# Altium schematic sheet Sensor.SchDoc
size A0
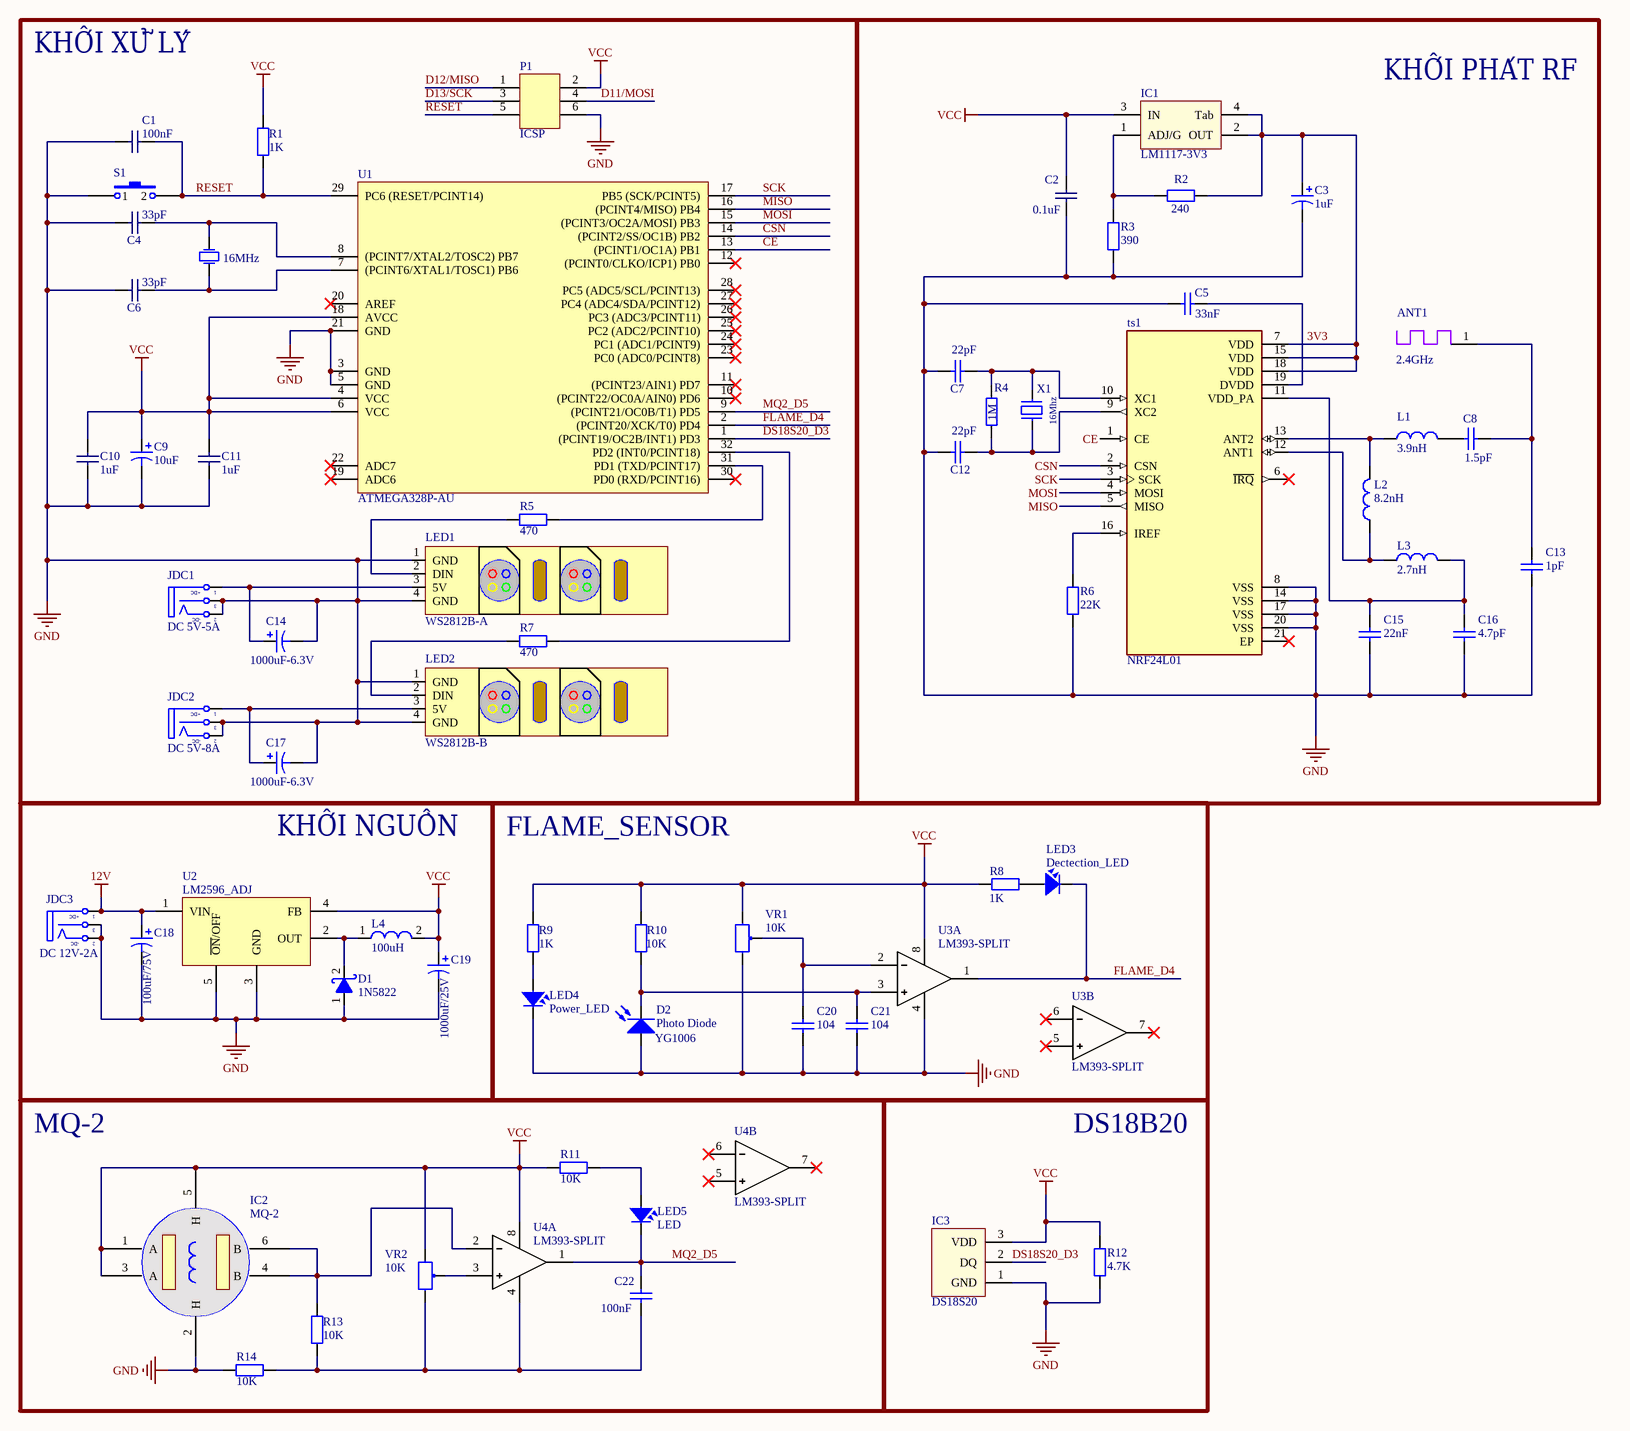
[diagram p0: Sensor.SchDoc]

## Parts
ANT1  2.4GHz  [PATCH ANTEN 2.45GHZ]
C1  100nF  [CAP0603]
C2  0.1uF  [CAPC0805]
C3  1uF  [CAP_0805]
C4  33pF  [CAP0603]
C5  33nF  [CAPC0805]
C6  33pF  [CAP0603]
C7  22pF  [CAPC0805]
C8  1.5pF  [CAPC0805]
C9  10uF  [CAP1206_TANTALUM_YELLOW]
C10  1uF  [CAP0603]
C11  1uF  [CAP0603]
C12  22pF  [CAPC0805]
C13  1pF  [CAPC0805]
C14  1000uF-6.3V  [CAP-ALU-SMD-J]
C15  22nF  [CAPC0805]
C16  4.7pF  [CAPC0805]
C17  1000uF-6.3V  [CAP-ALU-SMD-J]
C18  100uF/75V  [C5mm]
C19  1000uF/25V  [C5mm]
C20  104  [C0805]
C21  104  [C0805]
C22  100nF  [CAP_0805]
D1  1N5822  [DIOAD3070W130L950D530]
D2  Photo Diode  [LED-5 GRe]
IC1  LM1117-3V3  [SOT223-4N]
IC2  MQ-2  [MQ-2]
IC3  DS18S20  [JP3-C1T]
JDC1  DC 5V-5A  [DC-IN]
JDC2  DC 5V-8A  [DC-IN]
JDC3  DC 12V-2A  [DC-IN]
L1  3.9nH  [INDC_DR127-1]
L2  8.2nH  [INDC_DR127-1]
L3  2.7nH  [INDC_DR127-1]
L4  100uH  [Inductor_SMD]
LED1  WS2812B-A  [WS2812B]
LED2  WS2812B-B  [WS2812B]
LED3  Dectection_LED  [LED-0805-Blue]
LED4  Power_LED  [LED-0805-Red]
LED5  LED  [LED-0805-Red]
P1  ICSP  [HDR_M_2X3_2.54]
R1  1K  [DIEN TRO 0805]
R2  240  [RES_SMD_0805]
R3  390  [RES_SMD_0805]
R4  1M  [RES_SMD_0805]
R5  470  [DIEN TRO 0805]
R6  22K  [RES_SMD_0805]
R7  470  [DIEN TRO 0805]
R8  1K  [DIEN TRO 0805]
R9  value 1K  [DIEN TRO 0805]  (hidden comment: R0805)
R10  10K  [DIEN TRO 0805]
R11  10K  [DIEN TRO 0805]
R12  4.7K  [RES-SMD-0805]
R13  10K  [DIEN TRO 0805]
R14  10K  [DIEN TRO 0805]
S1  RESET  [SW_B3U-1000P]  (value not drawn)
ts1  NRF24L01  [QFN50P400X400X95-21N]
U1  ATMEGA328P-AU  [TQFP-32]
U2  LM2596_ADJ  [TO263-5]
U3  LM393-SPLIT  [SO8]  (parts A,B of 2)
U4  LM393-SPLIT  [SO8]  (parts A,B of 2)
VR1  10K  [VR1]
VR2  10K  [VR1]
X1  16Mhz  [XTAL_SMD_HC-49S]
Y1  16MHz  [XTAL_SMD_HC-49S]

## Blocks framed on the sheet
KHỐI XỬ LÝ: C1 C4 C6 C9-C11 C14 C17 JDC1 JDC2 LED1 LED2 P1 R1 R5 R7 S1 U1 Y1
KHỐI PHÁT RF: ANT1 C2 C3 C5 C7 C8 C12 C13 C15 C16 IC1 L1-L3 R2-R4 R6 ts1 X1
KHỐI NGUỒN: C18 C19 D1 JDC3 L4 U2
FLAME_SENSOR: C20 C21 D2 LED3 LED4 R8-R10 U3 VR1
MQ-2: C22 IC2 LED5 R11 R13 R14 U4 VR2
DS18B20: IC3 R12

## Nets
12V: C18.1 JDC3.1(T) U2.1(VIN)
GND: C1.1 C2.1 C3.2 C4.1 C5.1 C6.1 C7.1 C9.2 C10.2 C11.2 C12.1 C13.1 C14.2 C15.1 C16.1 C17.2 C18.2 C19.2 C20.1 C21.1 D1.1(A) D2.1(A) IC2.2(H) IC3.1(GND) JDC1.2(TN) JDC1.3(S) JDC2.2(TN) JDC2.3(S) JDC3.2(TN) JDC3.3(S) LED1.1(GND) LED1.4(GND) LED2.1(GND) LED2.4(GND) LED4.2 P1.6 R3.1 R6.1 R12.1 R14.2 S1.1 ts1.8(VSS) ts1.14(VSS) ts1.17(VSS) ts1.20(VSS) U1.3(GND) U1.5(GND) U1.21(GND) U2.3(GND) U2.5(~{ON}/OFF) U3.4(Vcc-) VR1.3
VCC: C2.2 C9.1 C10.1 C11.1 C19.1 IC1.3(IN) IC2.1(A) IC2.3(A) IC2.5(H) IC3.3(VDD) L4.2 P1.2 R1.1 R8.2 R9.2 R10.2 R11.2 R12.2 U1.4(VCC) U1.6(VCC) U1.18(AVCC) U2.4(FB) U3.8(Vcc+) U4.8(Vcc+) VR1.1 VR2.1
3V3: C3.1 IC1.2(OUT) IC1.4(Tab) R2.1 ts1.7(VDD) ts1.15(VDD) ts1.18(VDD)
CE: ts1.1(CE) U1.13((PCINT1/OC1A)_PB1)
CSN: ts1.2(CSN) U1.14((PCINT2/SS/OC1B)_PB2)
D11/MOSI: P1.4
D12/MISO: P1.1
D13/SCK: P1.3
DS18S20_D3: IC3.2(DQ) U1.1((PCINT19/OC2B/INT1)_PD3)
FLAME_D4: LED3.2 U1.2((PCINT20/XCK/T0)_PD4) U3.1
MISO: ts1.5(MISO) U1.16((PCINT4/MISO)_PB4)
MOSI: ts1.4(MOSI) U1.15((PCINT3/OC2A/MOSI)_PB3)
MQ2_D5: C22.2 LED5.2 U1.9((PCINT21/OC0B/T1)_PD5) U4.1
RESET: C1.2 P1.5 R1.2 S1.2 U1.29(PC6_(RESET/PCINT14))
SCK: ts1.3(SCK) U1.17(PB5_(SCK/PCINT5))
NetANT1_1: ANT1.1(ANT) C8.2 C13.2
NetC4_2: C4.2 U1.8((PCINT7/XTAL2/TOSC2)_PB7) Y1.2(OSC2)
NetC5_2: C5.2 ts1.19(DVDD)
NetC6_2: C6.2 U1.7((PCINT6/XTAL1/TOSC1)_PB6) Y1.1(OSC1)
NetC7_2: C7.2 R4.2 ts1.10(XC1) X1.1
NetC8_1: C8.1 L1.2
NetC12_2: C12.2 R4.1 ts1.9(XC2) X1.2
NetC14_1: C14.1 JDC1.1(T) LED1.3(5V)
NetC15_2: C15.2 C16.2 L3.2 ts1.11(VDD_PA)
NetC17_1: C17.1 JDC2.1(T) LED2.3(5V)
NetC20_2: C20.2 U3.2 VR1.2
NetC21_2: C21.2 D2.2(K) R10.1 U3.3
NetC22_1: C22.1 R13.2 R14.1 U4.4(Vcc-) VR2.3
NetD1_2: D1.2(K) L4.1 U2.2(OUT)
NetIC1_1: IC1.1(ADJ/G) R2.2 R3.2
NetIC2_4: IC2.4(B) IC2.6(B) R13.1 U4.2
NetL1_1: L1.1 L2.2 ts1.13(ANT2)
NetL2_1: L2.1 L3.1 ts1.12(ANT1)
NetLED1_2: LED1.2(DIN) R5.2
NetLED2_2: LED2.2(DIN) R7.2
NetLED3_1: LED3.1 R8.1
NetLED4_1: LED4.1 R9.1
NetLED5_1: LED5.1 R11.1
NetR5_1: R5.1 U1.31(PD1_(TXD/PCINT17))
NetR6_2: R6.2 ts1.16(IREF)
NetR7_1: R7.1 U1.32(PD2_(INT0/PCINT18))
NetU4_3: U4.3 VR2.2

Not connected (* = marked no-connect by the designer): ts1 6(~{IRQ})* 21(EP)*; U1 10((PCINT22/OC0A/AIN0)_PD6)* 11((PCINT23/AIN1)_PD7)* 12((PCINT0/CLKO/ICP1)_PB0)* 19(ADC6)* 20(AREF)* 22(ADC7)* 23(PC0_(ADC0/PCINT8))* 24(PC1_(ADC1/PCINT9))* 25(PC2_(ADC2/PCINT10))* 26(PC3_(ADC3/PCINT11))* 27(PC4_(ADC4/SDA/PCINT12))* 28(PC5_(ADC5/SCL/PCINT13))* 30(PD0_(RXD/PCINT16))*; U3 5* 6* 7*; U4 5* 6* 7*

## Notes on the sheet
- (in symbol DCIN) +DC; -DC

## Library data of the parts
ANT1 = PCB antenna 2.45GHZ: Value: 2.45GHz
C1 C2 C4 C6 C10 C11 = capacitor_non_polar: capacitor non polar
C3 C14 C17-C19 = Cap Pol 5mm: Polarized Capacitor (Axial); Published: 8-Jun-2000; LatestRevisionDate: 17-Jul-2002; LatestRevisionNote: Re-released for DXP Platform.; PackageReference: POLAR0.8; Publisher: Altium Limited
C5 C7 C8 C12 C16 = CapCeramic: Capacitor; Published: 8-Jun-2000; LatestRevisionDate: 17-Jul-2002; LatestRevisionNote: Re-released for DXP Platform.; PackageReference: RAD-0.3; Publisher: Altium Limited
  C5: Value: 33nF
  C7 C12: Value: 22pF
  C8: Value: 1.5pF
  C16: Value: 4.7pF
C9 = T491A106K016AT: CAP TANT 10UF 16V 10% 1206; Manufacturer 1: KEMET; Manufacturer Size Code: A; Category 1: Capacitors; Capacitance: 10µF; Type: Molded; ESR (Equivalent Series Resistance): 7 Ohm; Lifetime @ Temp.: 2000 Hrs @ 85°C; Supplier 1: Digi-Key; Supplier Part Number 1: 399-8269-1-ND; Manufacturer Part Number 1: T491A106K016AT; RoHS 1: RoHS Compliant; Description 1: CAP TANT 10UF 16V 10% 1206; Stock 1: 54083; Pricing 1: 1=0.45, 10=0.312, 100=0.1873, 500=0.14048, 1000=0.11862 (USD); Packaging: Cut Tape (CT); Part Status: Active; Operating Temperature: -55°C ~ 125°C; Mounting Type: Surface Mount; Package / Case: 1206 (3216 Metric); Size / Dimension: 0.126" L x 0.063" W (3.20mm x 1.60mm); Height - Seated (Max): 0.071" (1.80mm); Lead Spacing: -; Features: General Purpose; Failure Rate: -; ComponentLink1URL: http://www.kemet.com/Lists/ProductCatalog/Attachments/254/KEM_T2005_T491.pdf; ComponentLink1Description: http://www.kemet.com/Lists/ProductCatalog/Attachments/254/KEM_T2005_T491.pdf; Value: 10uF; Tolerance: ±10%; Voltage - Rated: 16V
C13 = CapCeramic: Capacitor; Value: 33p; Published: 8-Jun-2000; LatestRevisionDate: 17-Jul-2002; LatestRevisionNote: Re-released for DXP Platform.; PackageReference: RAD-0.3; Publisher: Altium Limited
C15 = CapCeramic: Capacitor; Value: 2.2nF; Published: 8-Jun-2000; LatestRevisionDate: 17-Jul-2002; LatestRevisionNote: Re-released for DXP Platform.; PackageReference: RAD-0.3; Publisher: Altium Limited
C20 C21 = CapSMD: Capacitor; Value: 33p; Published: 8-Jun-2000; LatestRevisionDate: 17-Jul-2002; LatestRevisionNote: Re-released for DXP Platform.; PackageReference: RAD-0.3; Publisher: Altium Limited
C22 = CapCeramic: Capacitor; Value: 0.1uF; Published: 8-Jun-2000; LatestRevisionDate: 17-Jul-2002; LatestRevisionNote: Re-released for DXP Platform.; PackageReference: RAD-0.3; Publisher: Altium Limited
D1 = 1N5822: Schottky Rectifiers; Value: Diode c?m 1N5408
D2 = Photo Diode: Photosensitive Diode; YG1006: YG1006
IC1 = LM1117_1: 3v3; Value: LM317
IC2 = MQ-2: MQ-2 GAS SENSOR
IC3 = DS18S20: High Precision  1-Wire® Digital Thermometer
JDC1-JDC3 = DCIN: Jac DC input; Value: Jac DC
L1-L3 = L1: Inductor; Value: 150 mH
L4 = Inductor: Value: 150 mH
LED1 LED2 = WS2812B
LED3 LED4 = LED SMD: Value: LED 3 - 5 ly 2 Colour
LED5 = LED: LED Single colour Green and Red; Value: LED 3 ly Single Colour
P1 = header_2x3pins
R1 R5 R7 R8 R10 R11 R13 R14 = R0805: Resistor SMD 0805; Value: 0805; Published: 8-Jun-2000; LatestRevisionDate: 17-Jul-2002; LatestRevisionNote: Re-released for DXP Platform.; PackageReference: AXIAL-0.4; Publisher: Altium Limited
R2-R4 R6 R12 = R1/4W: Resistor 1/4W; Value: R1/4W - 1K
R9 = R0805: Resistor SMD 0805; Published: 8-Jun-2000; LatestRevisionDate: 17-Jul-2002; LatestRevisionNote: Re-released for DXP Platform.; PackageReference: AXIAL-0.4; Publisher: Altium Limited
S1 = SW-PB-2pin: Switch; Published: 24-Mar-1999; LatestRevisionDate: 17-Jul-2002; LatestRevisionNote: Re-released for DXP Platform.; PackageReference: SPST-2; Publisher: Altium Limited
ts1 = NRF24L01: IC RF TxRx Only General ISM > 1GHZ 2.4GHz 20-VFQFN Exposed Pad; MP: NRF24L01+; MF: Nordic Semiconductor; Availability: Unavailable; Package: QFN-20 Nordic Semiconductor; SnapEDA_Link: https://www.snapeda.com/parts/NRF24L01%2B/Nordic%20Semiconductor%20ASA/view-part/1023904/?ref=snap; Value: *; Price: None
U1 = atmega328p-au: AVR AVR® ATmega Microcontroller IC 8-Bit 20MHz 32KB (16K x 16) FLASH 32-TQFP (7x7)
U3 U4 = LM393-SPLIT: IC DUAL COMPARATOR; Supplier 1: Digi-Key; Supplier Part Number 1: LM393MXFSDKR-ND
VR1 VR2 = VR: Var Resistor; Value: VR 10K
X1 = XT2: Crystal For all Crystal 2pin.; Value: 4Mhz
Y1 = XTAL: Crystal Oscillator; Published: 8-Jun-2000; LatestRevisionDate: 17-Jul-2002; LatestRevisionNote: Re-released for DXP Platform.; PackageReference: R38; Publisher: Altium Limited